# EAGLE design FilamentRecyclePeriphery (EAGLE 6.6.0)
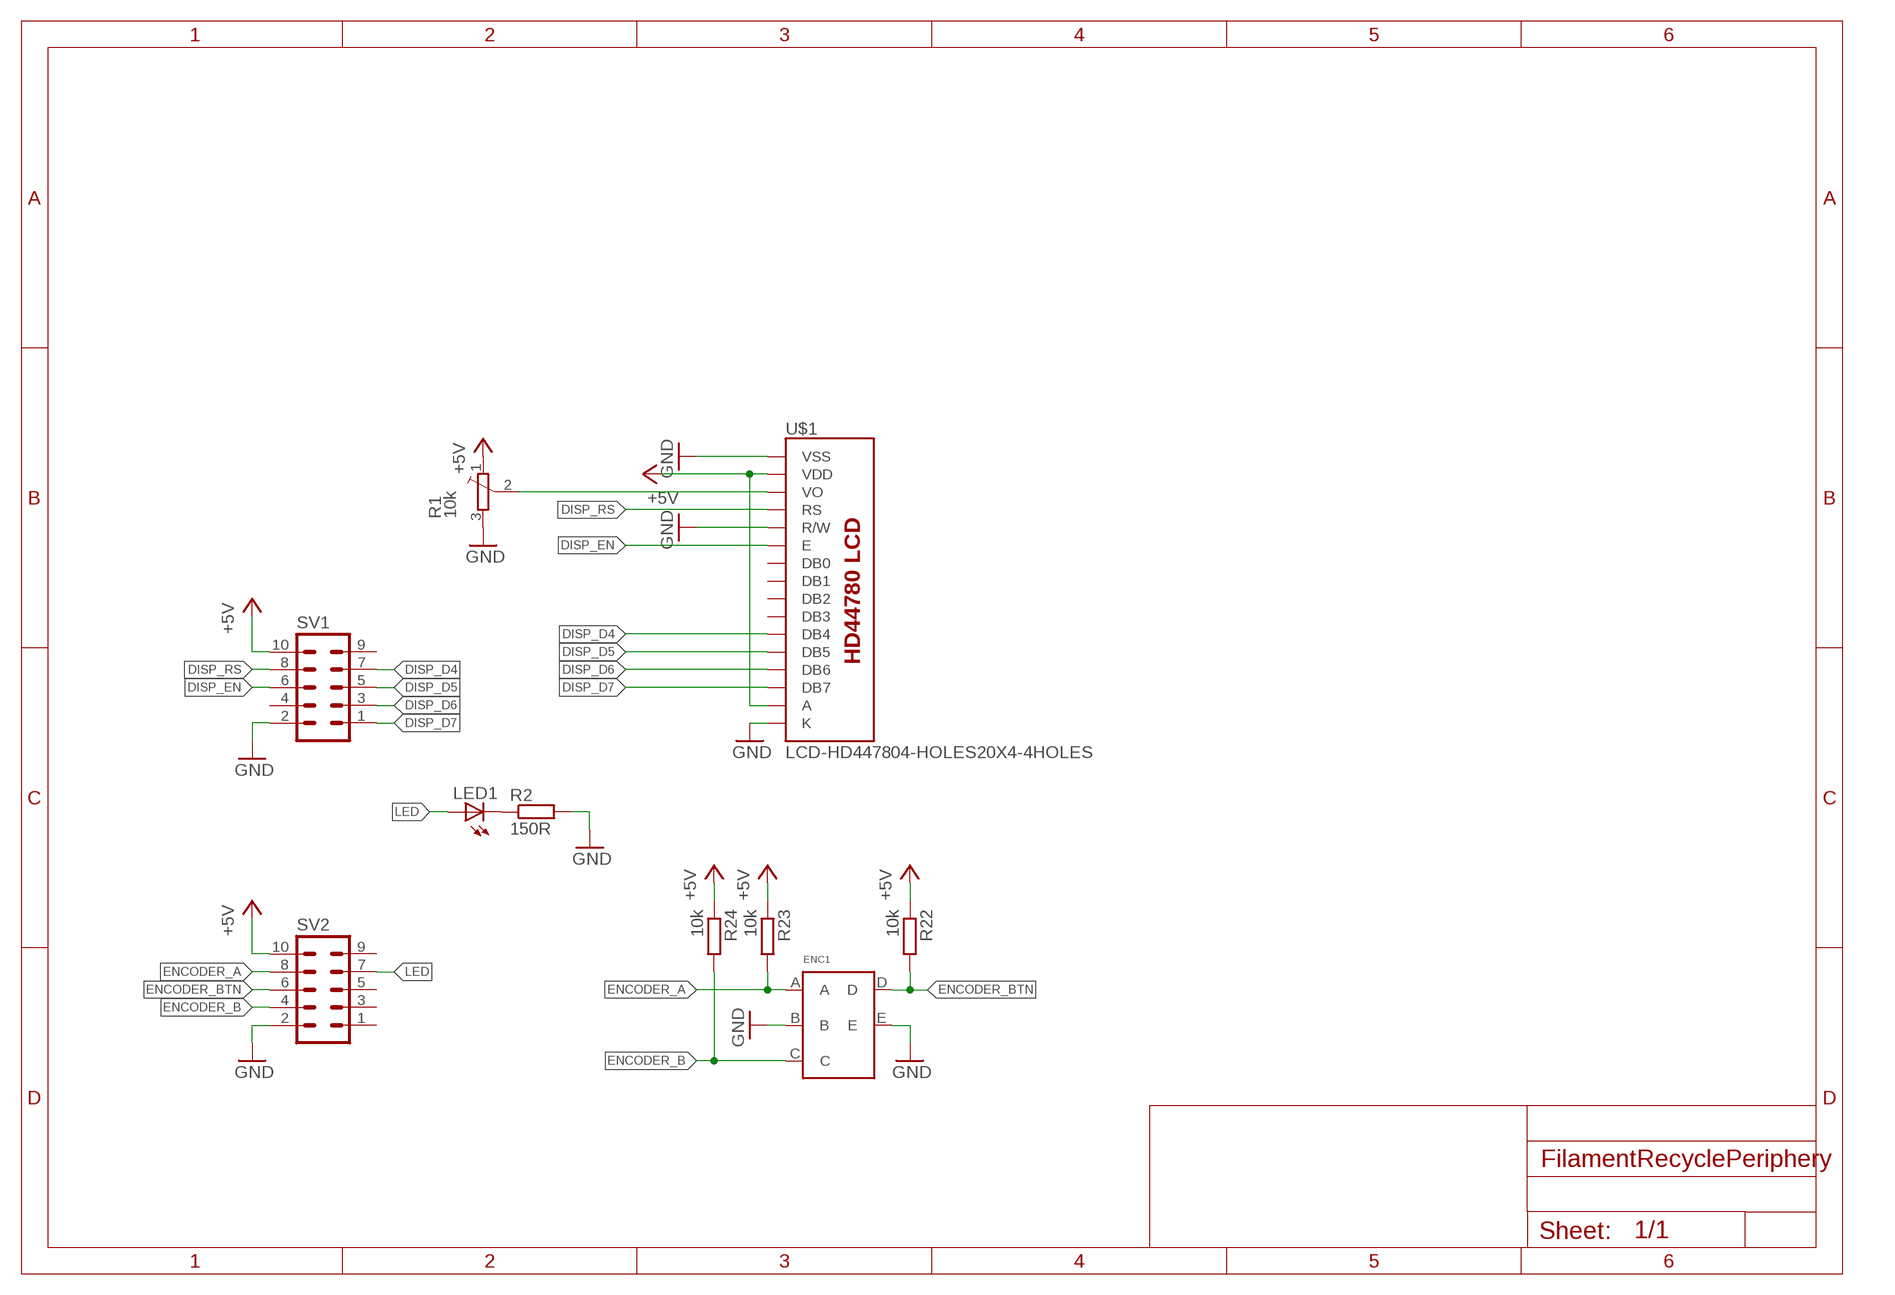
[diagram p0: schematic, sheet 1]

## Parts
ENC1  ENCODER  [ENCODER]
LED1  LED3MM  [LED3MM]
R1  10k  35WR5KLFTR  [35WR5KLFTR]
R2  150R  R-EU_R0603  [R0603]
R22  10k  R-EU_R0603  [R0603]
R23  10k  R-EU_R0603  [R0603]
R24  10k  R-EU_R0603  [R0603]
SV1  ML10  [ML10]
SV2  ML10  [ML10]
U$1  LCD-HD447804-HOLES20X4-4HOLES  [LCD-20X4-4HOLES]

## Nets
+5V: R1.1(E) R22.1 R23.1 R24.1 SV1.10 SV2.10 U$1.P$2(VDD) U$1.P$15(A)
DISP_D4: SV1.7 U$1.P$11(DB4)
DISP_D5: SV1.5 U$1.P$12(DB5)
DISP_D6: SV1.3 U$1.P$13(DB6)
DISP_D7: SV1.1 U$1.P$14(DB7)
DISP_EN: SV1.6 U$1.P$6(E)
DISP_RS: SV1.8 U$1.P$4(RS)
ENCODER_A: ENC1.A R23.2 SV2.8
ENCODER_B: ENC1.C R24.2 SV2.4
ENCODER_BTN: ENC1.D R22.2 SV2.6
GND: ENC1.B ENC1.E R1.3(A) R2.2 SV1.2 SV2.2 U$1.P$1(VSS) U$1.P$5(R/W) U$1.P$16(K)
LED: LED1.A SV2.7
N$1: LED1.K(C) R2.1
N$5: R1.2(S) U$1.P$3(VO)
Unconnected: SV1.4 SV1.9 SV2.1 SV2.3 SV2.5 SV2.9 U$1.P$7(DB0) U$1.P$8(DB1) U$1.P$9(DB2) U$1.P$10(DB3)

## Library data of the parts
ENC1 = encoder:ENCODER
LED1 = led:LED: LED OSRAM: - CHIPLED LG R971, LG N971, LY N971, LG Q971, LY Q971, LO R971, LY R971 LH N974, LH R974 LS Q976, LO Q976, LY Q976 LO Q996 - Hyper CHIPLED LW Q18S LB Q993, LB Q99A, LB R99A - SideLED LS A670, LO A670, LY A670, LG A670, LP A670 LB A673, LV A673, LT A673, LW A673 LH A674 LY A675 LS A676, LA A676, LO A676, LY A676, LW A676 LS A679, LY A679, LG A679 - Hyper Micro SIDELED® LS Y876, LA Y876, LO Y876, LY Y876 LT Y87S - SmartLED LW L88C, LW L88S LB L89C, LB L89S, LG L890 LS L89K, LO L89K, LY L89K LS L896, LA L896, LO L896, LY L896 - TOPLED LS T670, LO T670, LY T670, LG T670, LP T670 LSG T670, LSP T670, LSY T670, LOP T670, LYG T670 LG T671, LOG T671, LSG T671 LB T673, LV T673, LT T673, LW T673 LH T674 LS T676, LA T676, LO T676, LY T676, LB T676, LH T676, LSB T676, LW T676 LB T67C, LV T67C, LT T67C, LS T67K, LO T67K, LY T67K, LW E67C LS E67B, LA E67B, LO E67B, LY E67B, LB E67C, LV E67C, LT E67C LW T67C LS T679, LY T679, LG T679 LS T770, LO T770, LY T770, LG T770, LP T770 LB T773, LV T773, LT T773, LW T773 LH T774 LS E675, LA E675, LY E675, LS T675 LS T776, LA T776, LO T776, LY T776, LB T776 LHGB T686 LT T68C, LB T68C - Hyper Mini TOPLED® LB M676 - Mini TOPLED Santana® LG M470 LS M47K, LO M47K, LY M47K Source: http://www.osram.convergy.de LUXEON: - LUMILED® LXK2-PW12-R00, LXK2-PW12-S00, LXK2-PW14-U00, LXK2-PW14-V00 LXK2-PM12-R00, LXK2-PM12-S00, LXK2-PM14-U00 LXK2-PE12-Q00, LXK2-PE12-R00, LXK2-PE12-S00, LXK2-PE14-T00, LXK2-PE14-U00 LXK2-PB12-K00, LXK2-PB12-L00, LXK2-PB12-M00, LXK2-PB14-N00, LXK2-PB14-P00, LXK2-PB14-Q00 LXK2-PR12-L00, LXK2-PR12-M00, LXK2-PR14-Q00, LXK2-PR14-R00 LXK2-PD12-Q00, LXK2-PD12-R00, LXK2-PD12-S00 LXK2-PH12-R00, LXK2-PH12-S00 LXK2-PL12-P00, LXK2-PL12-Q00, LXK2-PL12-R00 Source: www.luxeon.com KINGBRIGHT: KA-3528ASYC Source: www.kingbright.com
R1 = SchlegelAr_Master:35WR5KLFTR: 35WR5KLFTR - Trimmerwiderstände – SMD 5K OHM 3MM ST CERM last modified: Armin Schlegel, 28.04.2014 http://de.mouser.com/ProductDetail/BI-Technologies-TT-electronics/35WR5KLFTR/?qs=sGAEpiMZZMvygUB3GLcD7k0onkdf2zwbjj6v9Mqce6o%3d http://www.mouser.com/ds/2/414/35-2231.pdf
R2 R22-R24 = rcl:R-EU_: RESISTOR, European symbol
SV1 SV2 = con-harting-ml:ML10: HARTING; OC_FARNELL: unknown; OC_NEWARK: unknown
U$1 = HD44780LCD:LCD-HD44780

## Board
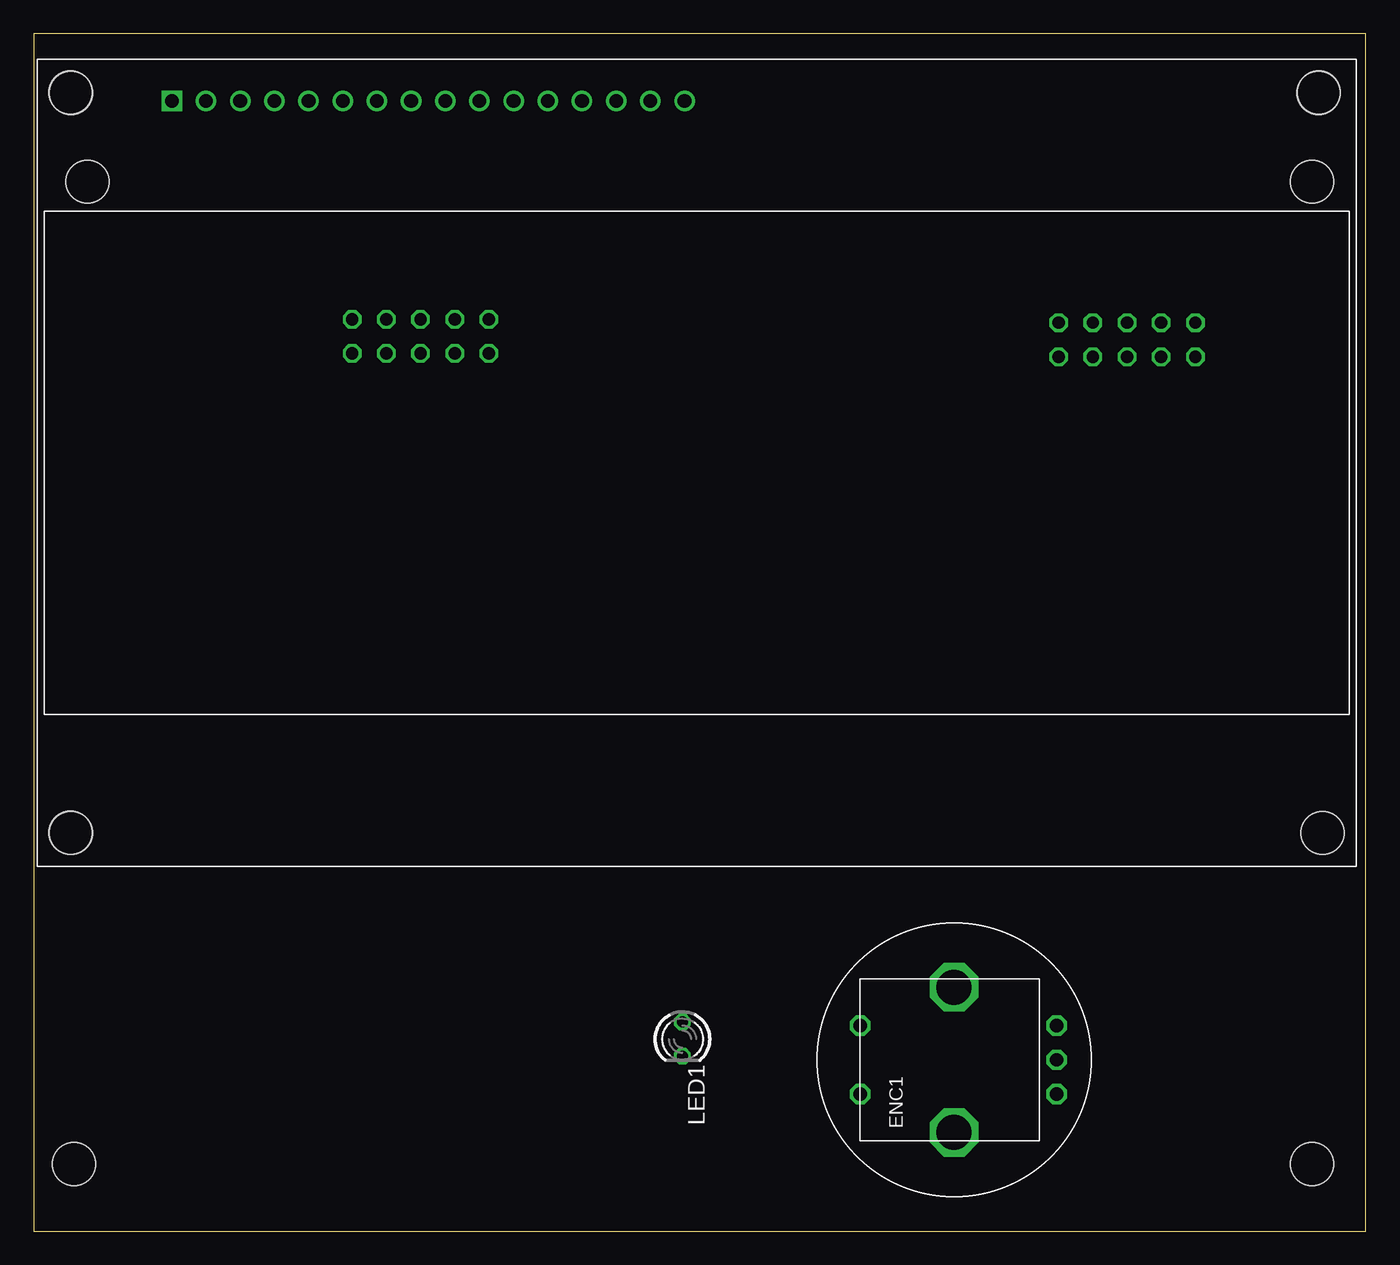
[diagram p1: board, top side]
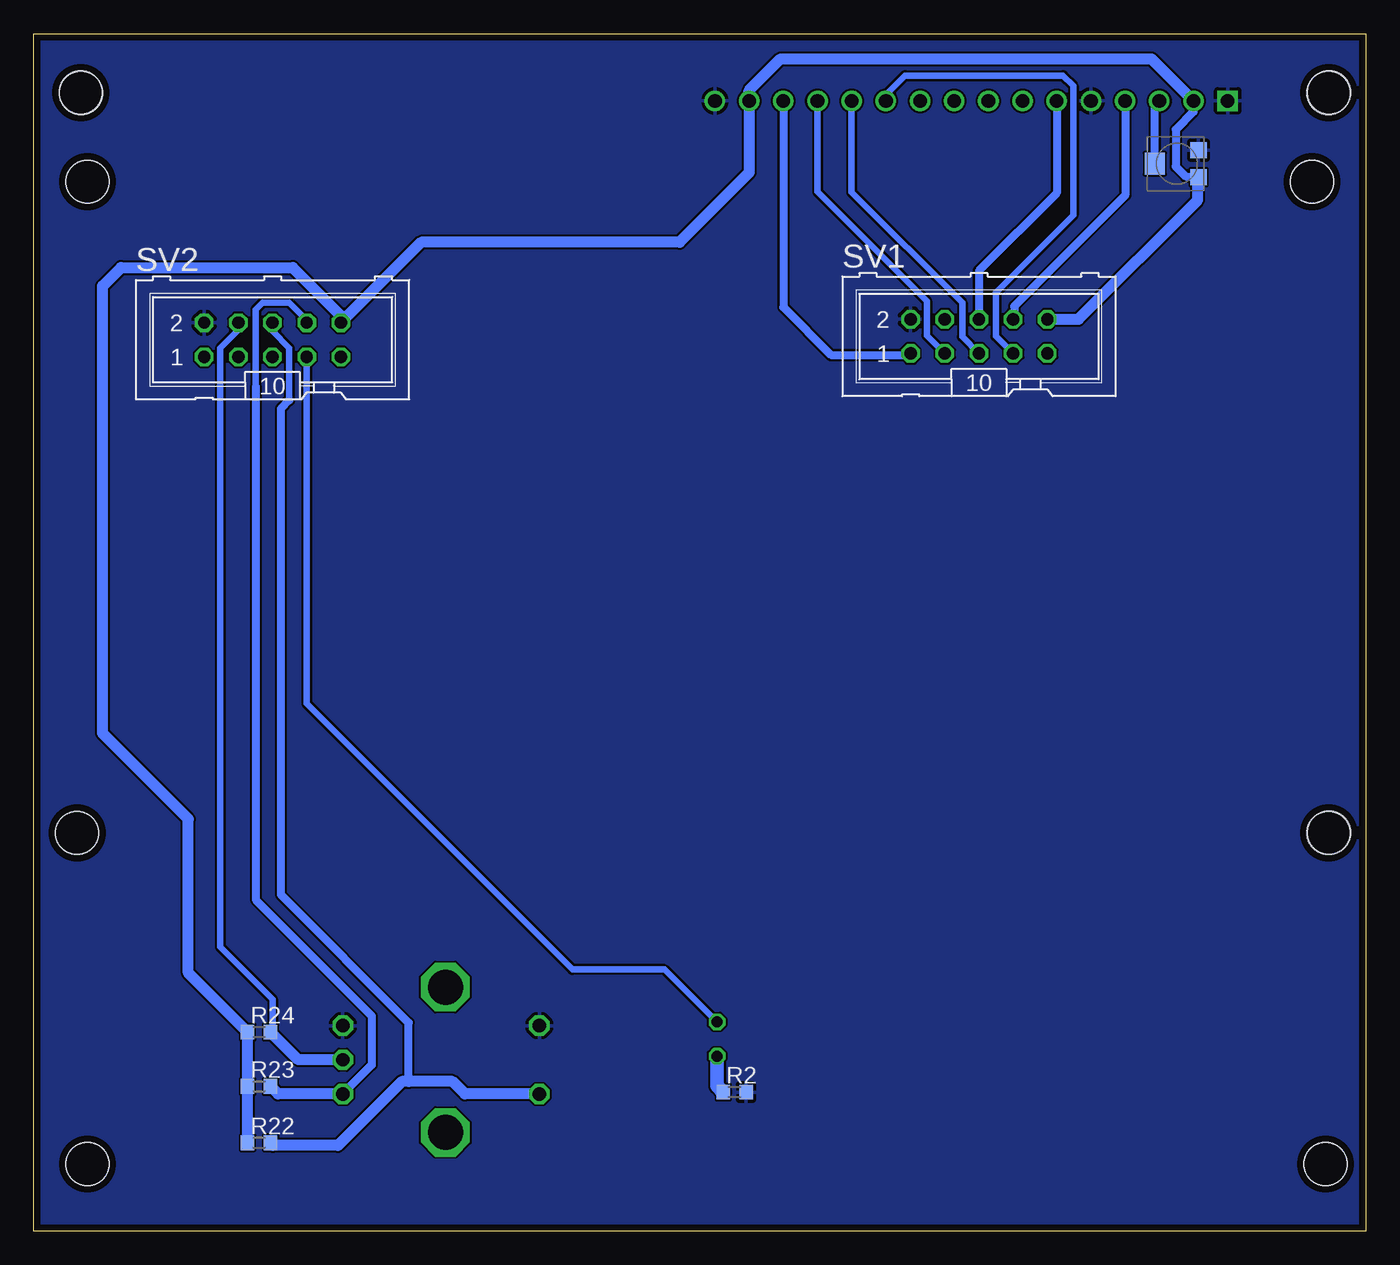
[diagram p2: board, bottom side, seen from below]

Size 99 x 89 mm. Coordinates in mm from the lower left corner, seen from the top.
Outline: 0,0 99,0 99,89 0,89 0,0
Copper layers (1*16): Top 0.035mm / dielectric 1.6mm / Bottom 0.035mm
Design rules "Elecrow_2-layer_PCB_eagle_rule": minimum track width 6mil, minimum drill 12mil, track to track 6mil, track to pad 6mil, pad to pad 6mil, via to via 8mil, smd to smd 0mil, copper to edge 20mil, drill to drill 10mil, minimum pad ring 6mil, minimum via ring 6mil, stop-mask expansion 0mil, vias tented up to drill 100mil, thermal gap 10mil
Holes 3.2 mm at 2.75,84.62 95.5,84.62 2.75,29.62 4,78 3,5 95,5 95,78

### Footprints (pad centres in the part's own frame; a part is rotated, then mirrored left to right if it is on the bottom)
ENCODER = drill 1 octagon: A -2.54,-7.62; B 2.54,-7.62; C 0,-7.62; D -2.54,6.985; E 2.54,6.985 | drill 2.6 octagon: P$1 5.397,0; P$2 -5.397,0
LED3MM = drill 0.813 octagon: A -1.27,0; K 1.27,0
35WR5KLFTR = smd 1.2 x 1.2: 1 -1.6,1; 3 -1.6,-1 | smd 1.5 x 1.6: 2 1.65,0
R0603 = smd 1 x 1.1: 1 -0.85,0; 2 0.85,0
ML10 = drill 0.914 octagon: 1 -5.08,-1.27; 2 -5.08,1.27; 3 -2.54,-1.27; 4 -2.54,1.27; 5 0,-1.27; 6 0,1.27; 7 2.54,-1.27; 8 2.54,1.27; 9 5.08,-1.27; 10 5.08,1.27
LCD-20X4-4HOLES = drill 1.016 square: P$1 10,56.9 | drill 1.016: P$2 12.54,56.9; P$3 15.08,56.9; P$4 17.62,56.9; P$5 20.16,56.9; P$6 22.7,56.9; P$7 25.24,56.9; P$8 27.78,56.9; P$9 30.32,56.9; P$10 32.86,56.9; P$11 35.4,56.9; P$12 37.94,56.9; P$13 40.48,56.9; P$14 43.02,56.9; P$15 45.56,56.9; P$16 48.1,56.9 | hole 3.2: 2.5,2.5; 2.5,57.5; 95.5,2.5; 95.21,57.5

### Placement (x,y rotation side)
ENC1  68.41,12.74 90 top
LED1  48.22,14.28 270 top
R1  14.04,79.34 180 bottom
R2  46.91,10.34 0 bottom
R22  82.25,6.57 0 bottom
R23  82.25,10.76 0 bottom
R24  82.25,14.8 0 bottom
SV1  28.75,66.5 0 bottom
SV2  81.25,66.25 0 bottom
U$1  0.27,27.1 0 top

### Tracks (layer width: path | path; a pad name or v marks a point on that pad's centre or on a via)
+5V
  Bottom 0.61: U$1.P$2 12.81,83.19 14.12,81.88 14.12,79.12 13.38,78.38 12.47,78.38 R1.1
  Bottom 0.813: U$1.P$2 15.94,87.12 43.5,87.12 45.83,84.8 U$1.P$15 45.83,78.67 51,73.5 70.19,73.5 SV2.10 76.17,68.05 79.75,71.62 92.5,71.62 93.88,70.25 93.88,37 87.5,30.62 87.5,19.2 R24.1 R23.1 R22.1 | SV1.10 21.36,67.77 12.5,76.62 12.5,78.27 R1.1
DISP_D4
  Bottom 0.5: U$1.P$11 35.67,84.45 34.25,85.88 22.5,85.88 21.75,85.12 21.75,75.5 27.5,69.75 27.5,66.52 SV1.7
DISP_D5
  Bottom 0.5: U$1.P$12 38.21,77.21 30,69 30,66.48 SV1.5
DISP_D6
  Bottom 0.5: U$1.P$13 40.75,77.25 32.62,69.12 32.62,66.56 SV1.3
DISP_D7
  Bottom 0.61: U$1.P$14 43.29,68.67 39.75,65.12 33.87,65.12 SV1.1
DISP_EN
  Bottom 0.61: U$1.P$6 22.97,77.16 28.75,71.38 SV1.6
DISP_RS
  Bottom 0.61: U$1.P$4 17.89,76.98 26.12,68.75 26.12,67.79 SV1.8
ENCODER_A
  Bottom 0.5: SV2.8 78.71,67.71 80,69 82,69 82.5,68.5 82.5,62.75
  Bottom 0.6: 82.5,62.75 82.5,24.62 73.88,16 73.88,12.35 ENC1.A
  Bottom 0.813: ENC1.A 80.84,10.2 R23.2
ENCODER_B
  Bottom 0.5: R24.2 81.25,14.95 81.25,17.25 85.12,21.12 85.12,65.62 83.79,66.96 SV2.4
  Bottom 0.813: ENC1.C 79.34,12.74 R24.2
ENCODER_BTN
  Bottom 0.5: SV2.6 81.25,66.88 80,65.62 80,61.75
  Bottom 0.6: 71.12,11.12 71.12,15.5 80.62,25 80.62,61.12 80,61.75
  Bottom 0.813: ENC1.D 66.95,10.2 67.88,11.12 71.12,11.12 71.62,11.12 76.38,6.38 81.2,6.38 R22.2
GND
  pour Bottom: 0,89 99,89 99,0 0,0
LED
  Bottom 0.5: LED1.A 52.12,19.46 58.96,19.46 78.71,39.21 SV2.7
N$1
  Bottom 1.016: LED1.K 48.22,10.8 R2.1
N$5
  Bottom 0.61: R1.2 15.69,83.66 U$1.P$3